# Altium schematic sheet File_Nguyen_Ly.SchDoc
size A
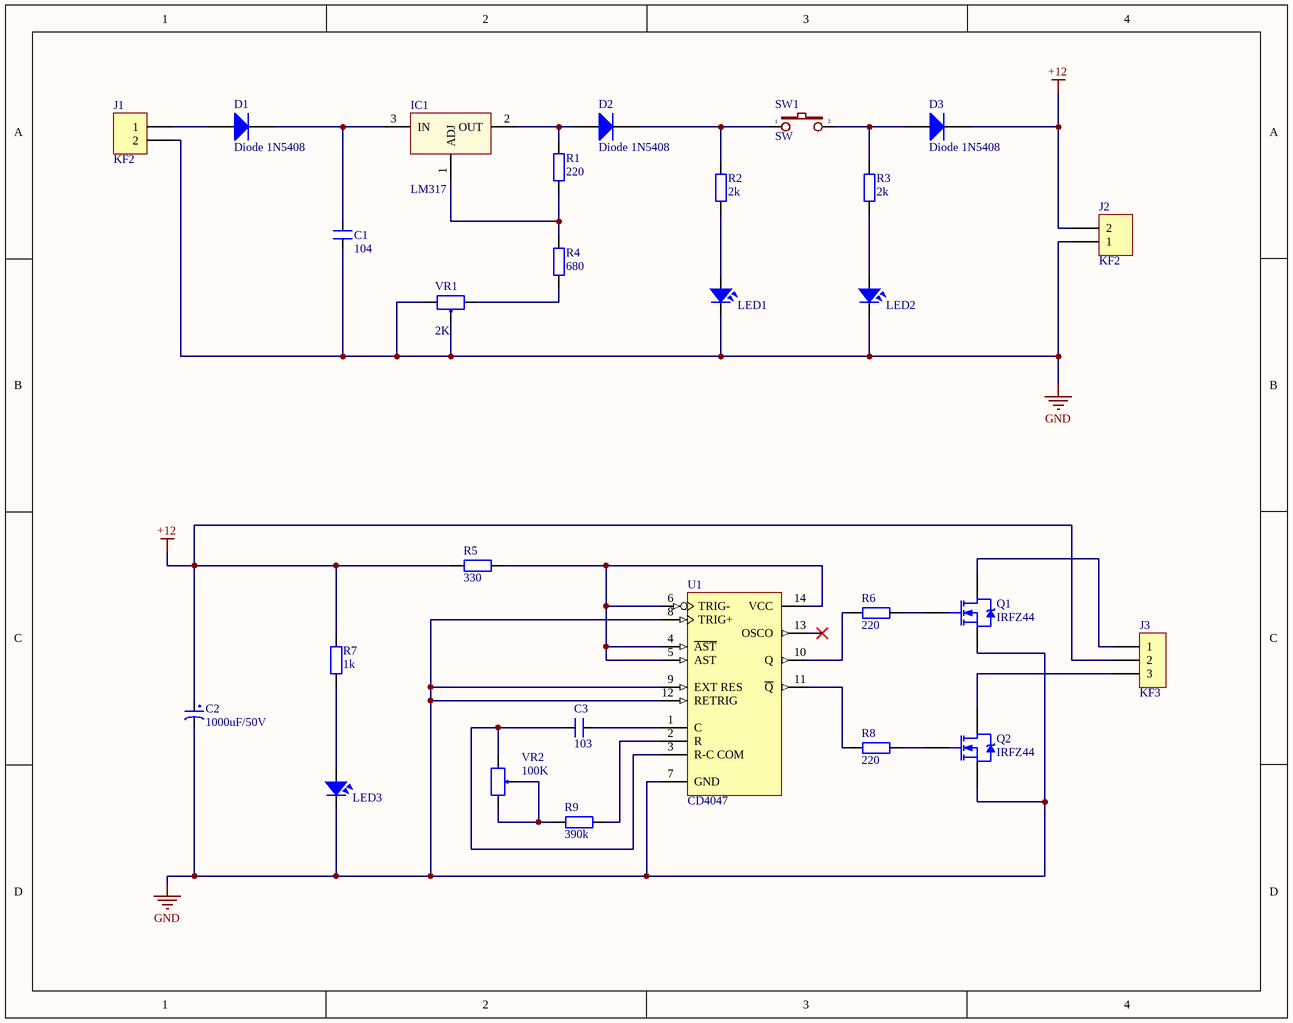
[diagram p0: File_Nguyen_Ly.SchDoc]

## Parts
C1  104  [CN2]
C2  1000uF/50V  [CP3/7]
C3  103  [CN1.5]
D1  Diode 1N5408  [DO-201AD]
D2  Diode 1N5408  [DO-201AD]
D3  Diode 1N5408  [DO-201AD]
IC1  LM317  [TO220H1]
J1  KF2  [KF2-5.08]
J2  KF2  [KF2-7.62]
J3  KF3  [KF3-7.62]
LED1  LED  [LED-5-Green]  (value not drawn)
LED2  LED  [LED-5-RED]  (value not drawn)
LED3  LED  [LED-5-BLUE]  (value not drawn)
Q1  IRFZ44  [TO220H2]
Q2  IRFZ44  [TO220H2]
R1  220  [R1/4W]
R2  2k  [R1/4W]
R3  2k  [R1/4W]
R4  680  [R1/4W]
R5  330  [R1/4W]
R6  220  [R1/2W]
R7  1k  [R1/4W]
R8  220  [R1/2W]
R9  390k  [R1/4W]
SW1  SW  [SW-DIP1-1]
U1  CD4047  [DIP14/W0.3]
VR1  2K  [VR]
VR2  100K  [VR]

## Nets
+12: C2.1 D3.2(K) J2.2 J3.2 R5.2 R7.2
GND: C1.1 C2.2 J1.2 J2.1 LED1.2 LED2.2 LED3.2 Q1.3(S) Q2.3(S) U1.7(GND) U1.8(TRIG+) U1.9(EXT_RES) U1.12(RETRIG) VR1.2 VR1.3
NetC1_2: C1.2 D1.2(K) IC1.3(IN)
NetC3_1: C3.1 U1.3(R-C_COM) VR2.1
NetC3_2: C3.2 U1.1(C)
NetD1_1: D1.1(A) J1.1
NetD2_1: D2.1(A) IC1.2(OUT) R1.2
NetD2_2: D2.2(K) R2.1 SW1.1
NetD3_1: D3.1(A) R3.1 SW1.2
NetIC1_1: IC1.1(ADJ) R1.1 R4.2
NetJ3_1: J3.1 Q1.2(D)
NetJ3_3: J3.3 Q2.2(D)
NetLED1_1: LED1.1 R2.2
NetLED2_1: LED2.1 R3.2
NetLED3_1: LED3.1 R7.1
NetQ1_1: Q1.1(G) R6.1
NetQ2_1: Q2.1(G) R8.1
NetR4_1: R4.1 VR1.1
NetR5_1: R5.1 U1.4(~{AST}) U1.5(AST) U1.6(TRIG-) U1.14(VCC)
NetR6_2: R6.2 U1.10(Q)
NetR8_2: R8.2 U1.11(~{Q})
NetR9_1: R9.1 U1.2(R)
NetR9_2: R9.2 VR2.2 VR2.3

Not connected (* = marked no-connect by the designer): U1 13(OSCO)*

## Library data of the parts
C1 = CN2: Cap np 104 => 105pF; Value: 0.1uF
C2 = CP6: Cap 4700uF/16V - 2200uF/50V; Description 5: 100uF=>220uF/200V -100uF=>330uF/350V; Description 1: 10KuF=>22KuF/6,3V - 6800uF=>15KuF/10V; Description 2: 4700uF=>10KuF/16V - 3300uF => 6800uF/25V; Description 3: 2200uF=>3300uF/50V_1KuF=>2200uF/63V; Description 4: 470uF => 1KuF/100V - 220uF-470uF/160V; Value: 2200uF/16V; Description 6: 33uF=>100/350V-400V  -  22uF=>33uF/450V
C3 = CN1.5: Cap np 682pF => 104pF; Value: 0.01uF
D1-D3 = Diode 1N5408: 3 Amp Medium Power Silicon Rectifier Diode; Published: 8-Jun-2000; LatestRevisionDate: 17-Jul-2002; LatestRevisionNote: Re-released for DXP Platform.; DatasheetVersion: Aug-1984; PackageReference: DO-201AD; Publisher: Altium Limited; PackageDescription: Diode, Axial; Body 9.5 x 5.3 mm (LxDia. max), Lead Dia. 1.32 mm (max); ComponentLink1Description: Manufacturer Link; ComponentLink1URL: http://www.irf.com/
IC1 = LM317: Adj Voltage +1.2 -> +37V; Value: LM317
J1 J2 = KF2: Manufacturer: Würth Elektronik eiSos GmbH; partNo: 691103110002; ComponentLink1 Description: Manufacturer; ComponentLink2 Description: Datasheet; NoPins: 2; Created Date: 29 October 2013; ComponentLink1URL: http://www.we-online.com; ComponentLink2URL: http://katalog.we-online.de/em/datasheet/6911031100xx.pdf; Created by: Karrer Zheng
J3 = KF3: Manufacturer: Würth Elektronik eiSos GmbH; partNo: 691103110003; ComponentLink1 Description: Manufacturer; ComponentLink2 Description: Datasheet; NoPins: 3; Created Date: 29 October 2013; ComponentLink1URL: http://www.we-online.com; ComponentLink2URL: http://katalog.we-online.de/em/datasheet/6911031100xx.pdf; Created by: Karrer Zheng
LED1-LED3 = LED: LED Single colour Green and Red; Value: LED 3 ly Single Colour
Q1 Q2 = IRFZ44: Value: IRF840
R1-R9 = R1/4W: Resistor 1/4W; Value: R1/4W - 1K
SW1 = SW2: Switch button 2 pin; Value: SW chip 2 pin
VR1 VR2 = VR: Var Resistor; Value: VR 10K